# EAGLE design toy (EAGLE 9.3.2)
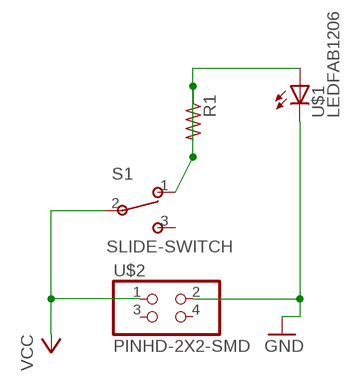
[diagram p0: schematic, sheet 1]

## Parts
R1  RES-US1206FAB  [R1206FAB]
S1  SLIDE-SWITCH  [AYZ0102AGRLC]
U$1  LEDFAB1206  [LED1206FAB]
U$2  PINHD-2X2-SMD  [2X02SMD]

## Nets
GND: U$1.2(C) U$2.2
N$1: R1.1 R1.2 S1.1 U$1.1(A)
VCC: S1.2 U$2.1
Unconnected: S1.3 U$2.3 U$2.4

## Library data of the parts
R1 = fab:RES-US: Resistor (US Symbol) Variants with postfix FAB are widened to allow the routing of internal traces
S1 = fab:SLIDE-SWITCH: SMD slide-switch AYZ0102AGRLC as found in the fablab inventory. Includes the mounting holes. Made by Zaerc.
U$1 = fab:LED: LED
U$2 = fab:PINHD-2X2-SMD

## Board
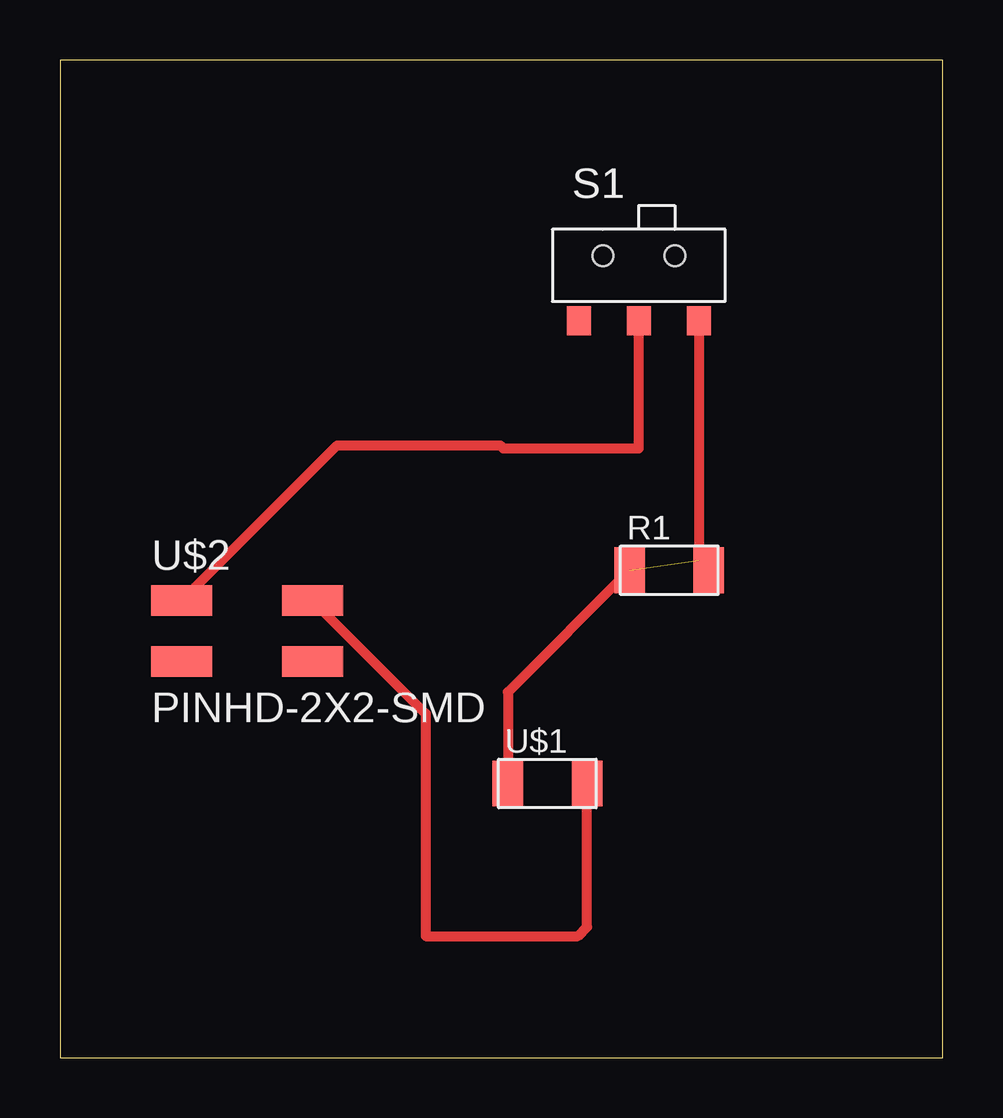
[diagram p1: board, top side]

Size 36.81 x 41.58 mm. Coordinates in mm from the lower left corner, seen from the top.
Outline: 0,0 36.81,0 36.81,41.58 0,41.58 0,0
Copper layers (1*16): Top 0.035mm / dielectric 1.5mm / Bottom 0.035mm
Design rules "default": minimum track width 6mil, minimum drill 0.35mm, track to track 6mil, track to pad 6mil, pad to pad 6mil, via to via 6mil, smd to smd 6mil, copper to edge 40mil, drill to drill 6mil, minimum pad ring 10mil, minimum via ring 8mil, stop-mask expansion 4mil, vias tented up to drill 0mil, thermal gap 10mil

### Footprints (pad centres in the part's own frame; a part is rotated, then mirrored left to right if it is on the bottom)
R1206FAB = smd 1.27 x 1.905: 1 -1.651,0; 2 1.651,0
AYZ0102AGRLC = smd 1 x 1.2: 1 2.5,-2.3; 2 0,-2.3; 3 -2.5,-2.3 | hole 0.85: -1.5,0.4; 1.5,0.4
LED1206FAB = smd 1.27 x 1.905: 1 -1.651,0; 2 1.651,0
2X02SMD = smd 2.54 x 1.27: 1 -2.54,1.27; 2 2.92,1.27; 3 -2.54,-1.27; 4 2.92,-1.27

### Placement (x,y rotation side)
R1  25.4,20.32 0 top
S1  24.13,33.02 0 top
U$1  20.32,11.43 0 top
U$2  7.62,17.78 0 top

### Tracks (layer width: path | path; a pad name or v marks a point on that pad's centre or on a via)
GND
  Top 0.406: U$2.2 15.24,14.35 15.24,5.08 21.59,5.08 21.97,5.46 U$1.2
N$1  (1 unrouted)
  Top 0.406: S1.1 26.63,20.74 R1.2 | R1.1 18.67,15.24 U$1.1
VCC
  Top 0.406: U$2.1 11.55,25.52 18.36,25.52 18.48,25.4 24.13,25.4 S1.2